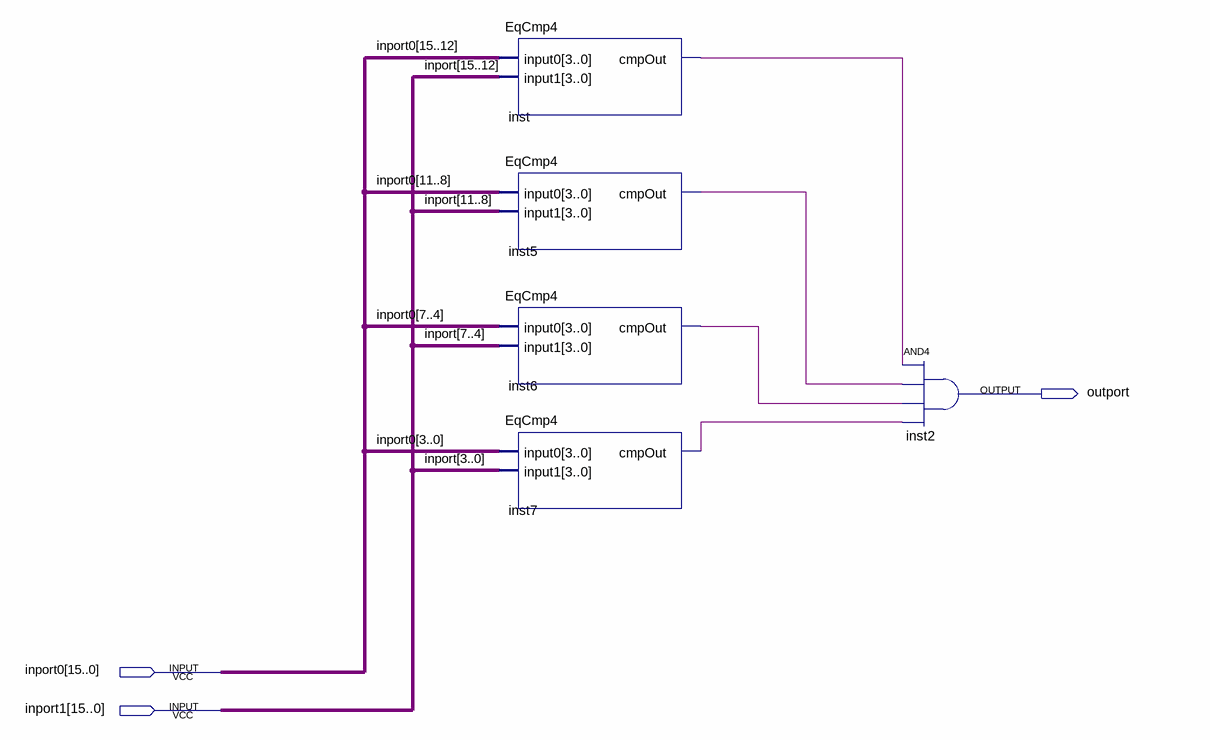
[diagram p0: schematic sheet]
// Quartus schematic EqCmp4_2.bdf as structural Verilog: 5 symbols, 3 pins
module EqCmp4_2 (
  input  [15:0] inport0,
  input  [15:0] inport1,
  output outport
);

  wire inst5_cmpout, inst6_cmpout, inst7_cmpout, inst_cmpout;
  wire [15:0] inport;

  EqCmp4 inst (.input0(inport0[15:12]), .input1(inport[15:12]), .cmpOut(inst_cmpout));
  EqCmp4 inst5 (.input0(inport0[11:8]), .input1(inport[11:8]), .cmpOut(inst5_cmpout));
  EqCmp4 inst6 (.input0(inport0[7:4]), .input1(inport[7:4]), .cmpOut(inst6_cmpout));
  EqCmp4 inst7 (.input0(inport0[3:0]), .input1(inport[3:0]), .cmpOut(inst7_cmpout));
  and inst2 (outport, inst_cmpout, inst5_cmpout, inst6_cmpout, inst7_cmpout);
endmodule
